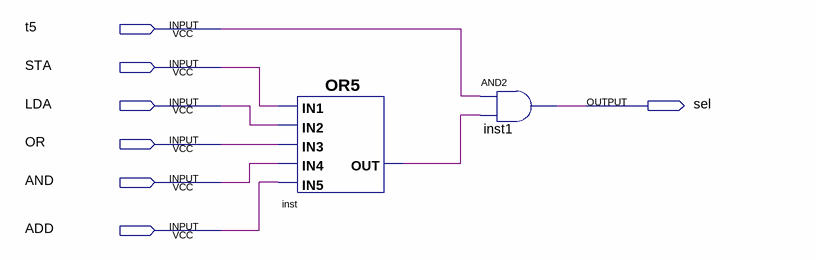
[diagram p0: schematic sheet]
// Quartus schematic sel.bdf as structural Verilog: 2 symbols, 7 pins
module sel (
  input  t5,
  input  STA,
  input  LDA,
  input  OR,
  input  AND,
  input  ADD,
  output sel
);

  wire inst_out;

  or inst (inst_out, STA, LDA, OR, AND, ADD);
  and inst1 (sel, t5, inst_out);
endmodule
